# Altium schematic sheet Power.SchDoc
size A; SheetNumber: 2; SheetTotal: 2
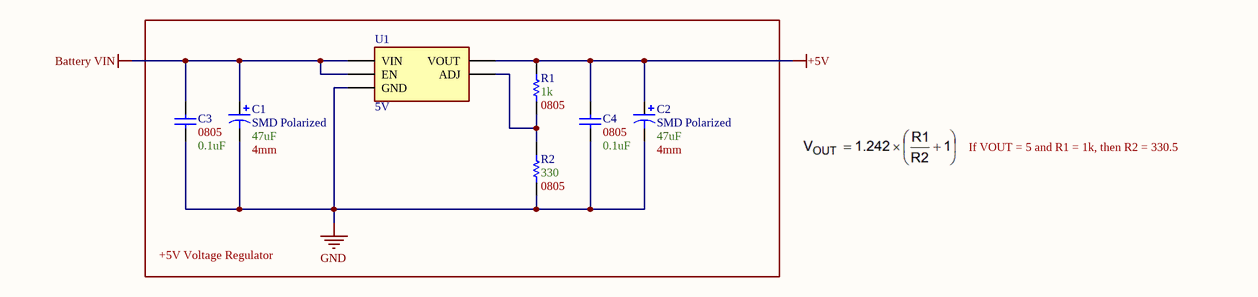
[diagram p0: Power.SchDoc]

## Parts
C1  SMD Polarized  Capacitance: 47uF  Diameter: 4mm  [[Cap] SMD Polarized, 4mm]
C2  SMD Polarized  Capacitance: 47uF  Diameter: 4mm  [[Cap] SMD Polarized, 4mm]
C3  Size Package: 0805  Capacitance: 0.1uF  [[Cap] SMD 0805]  (hidden comment: SMD Nonpolarized)
C4  Size Package: 0805  Capacitance: 0.1uF  [[Cap] SMD 0805]  (hidden comment: SMD Nonpolarized)
R1  Resistance: 1k  Size Package: 0805  [[Res] SMD 0805]  (hidden comment: [Res] SMD Resistor)
R2  Resistance: 330  Size Package: 0805  [[Res] SMD 0805]  (hidden comment: [Res] SMD Resistor)
U1  5V  [[Reg] Variable Voltage Regulator]

## Blocks framed on the sheet
+5V Voltage Regulator: C1-C4 R1 R2 U1

## Nets
+5V: C2.1 C4.2 R1.2 U1.4(VOUT)
Battery VIN: C1.1 C3.2 U1.1(EN) U1.2(VIN)
GND: C1.2 C2.2 C3.1 C4.1 R2.1 U1.3(GND)
NetR1_1: R1.1 R2.2 U1.5(ADJ)

## Notes on the sheet
- If VOUT = 5 and R1 = 1k, then R2 = 330.5

## Library data of the parts
C1 C2 = [Cap] SMD Polarized: JLC Part #: *; Mouser Part #: *
C3 C4 = [Cap] SMD Nonpolarized
U1 = [Reg] Variable Voltage Regulator: MIC29302WT